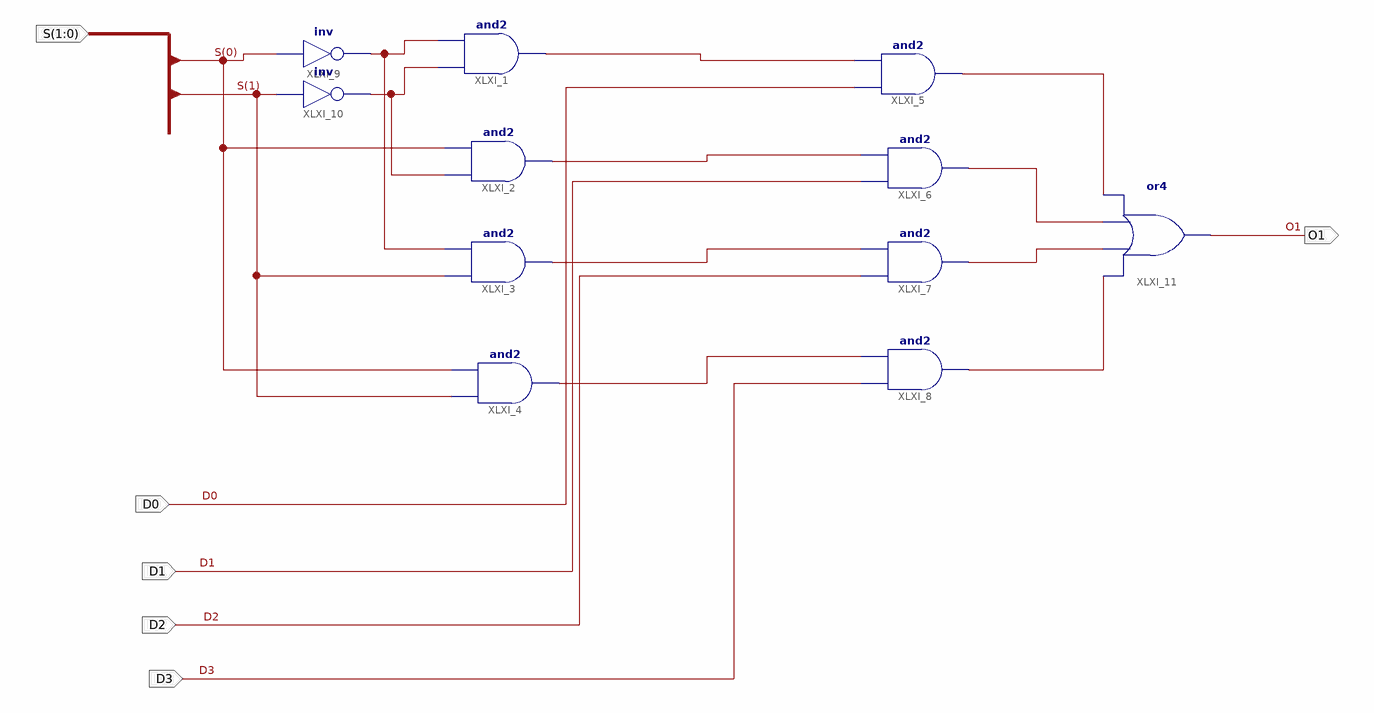
[diagram p0: schematic sheet 1]
// Xilinx ISE schematic Mux4to1.sch (kintex7) as structural Verilog: 11 symbols, 6 ports
module Mux4to1 (
  input  [1:0] S,
  input  D0,
  input  D1,
  input  D2,
  input  D3,
  output O1
);

  wire XLXN_7, XLXN_8, XLXN_13, XLXN_14, XLXN_15, XLXN_16, XLXN_21, XLXN_22, XLXN_23, XLXN_24;

  and XLXI_1 (XLXN_13, XLXN_7, XLXN_8);
  and XLXI_2 (XLXN_14, XLXN_7, S[0]);
  and XLXI_3 (XLXN_15, S[1], XLXN_8);
  and XLXI_4 (XLXN_16, S[1], S[0]);
  and XLXI_5 (XLXN_21, D0, XLXN_13);
  and XLXI_6 (XLXN_22, D1, XLXN_14);
  and XLXI_7 (XLXN_23, D2, XLXN_15);
  and XLXI_8 (XLXN_24, D3, XLXN_16);
  not XLXI_9 (XLXN_8, S[0]);
  not XLXI_10 (XLXN_7, S[1]);
  or XLXI_11 (O1, XLXN_24, XLXN_23, XLXN_22, XLXN_21);
endmodule
